# EAGLE design buttons_bevel (EAGLE 9.3.0)
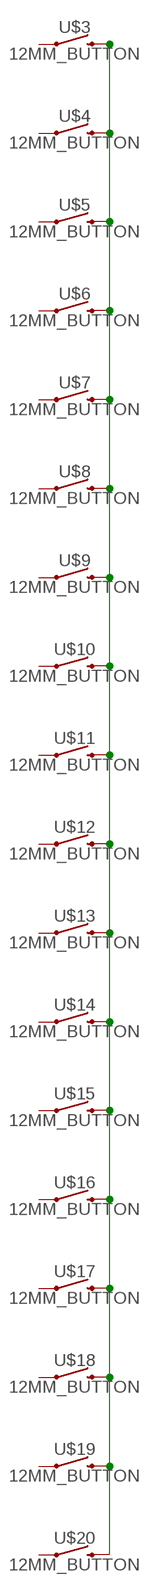
[diagram p0: schematic, sheet 1]

## Parts
U$3  12MM_BUTTON  [TACTILE_SWITCH_PTH_12MM]
U$4  12MM_BUTTON  [TACTILE_SWITCH_PTH_12MM]
U$5  12MM_BUTTON  [TACTILE_SWITCH_PTH_12MM]
U$6  12MM_BUTTON  [TACTILE_SWITCH_PTH_12MM]
U$7  12MM_BUTTON  [TACTILE_SWITCH_PTH_12MM]
U$8  12MM_BUTTON  [TACTILE_SWITCH_PTH_12MM]
U$9  12MM_BUTTON  [TACTILE_SWITCH_PTH_12MM]
U$10  12MM_BUTTON  [TACTILE_SWITCH_PTH_12MM]
U$11  12MM_BUTTON  [TACTILE_SWITCH_PTH_12MM]
U$12  12MM_BUTTON  [TACTILE_SWITCH_PTH_12MM]
U$13  12MM_BUTTON  [TACTILE_SWITCH_PTH_12MM]
U$14  12MM_BUTTON  [TACTILE_SWITCH_PTH_12MM]
U$15  12MM_BUTTON  [TACTILE_SWITCH_PTH_12MM]
U$16  12MM_BUTTON  [TACTILE_SWITCH_PTH_12MM]
U$17  12MM_BUTTON  [TACTILE_SWITCH_PTH_12MM]
U$18  12MM_BUTTON  [TACTILE_SWITCH_PTH_12MM]
U$19  12MM_BUTTON  [TACTILE_SWITCH_PTH_12MM]
U$20  12MM_BUTTON  [TACTILE_SWITCH_PTH_12MM]

## Nets
N$22: U$3.3 U$3.4 U$4.3 U$4.4 U$5.3 U$5.4 U$6.3 U$6.4 U$7.3 U$7.4 U$8.3 U$8.4 U$9.3 U$9.4 U$10.3 U$10.4 U$11.3 U$11.4 U$12.3 U$12.4 U$13.3 U$13.4 U$14.3 U$14.4 U$15.3 U$15.4 U$16.3 U$16.4 U$17.3 U$17.4 U$18.3 U$18.4 U$19.3 U$19.4 U$20.3 U$20.4
Unconnected: U$3.1 U$3.2 U$4.1 U$4.2 U$5.1 U$5.2 U$6.1 U$6.2 U$7.1 U$7.2 U$8.1 U$8.2 U$9.1 U$9.2 U$10.1 U$10.2 U$11.1 U$11.2 U$12.1 U$12.2 U$13.1 U$13.2 U$14.1 U$14.2 U$15.1 U$15.2 U$16.1 U$16.2 U$17.1 U$17.2 U$18.1 U$18.2 U$19.1 U$19.2 U$20.1 U$20.2

## Library data of the parts
U$3-U$20 = button:12MM_BUTTON

## Board
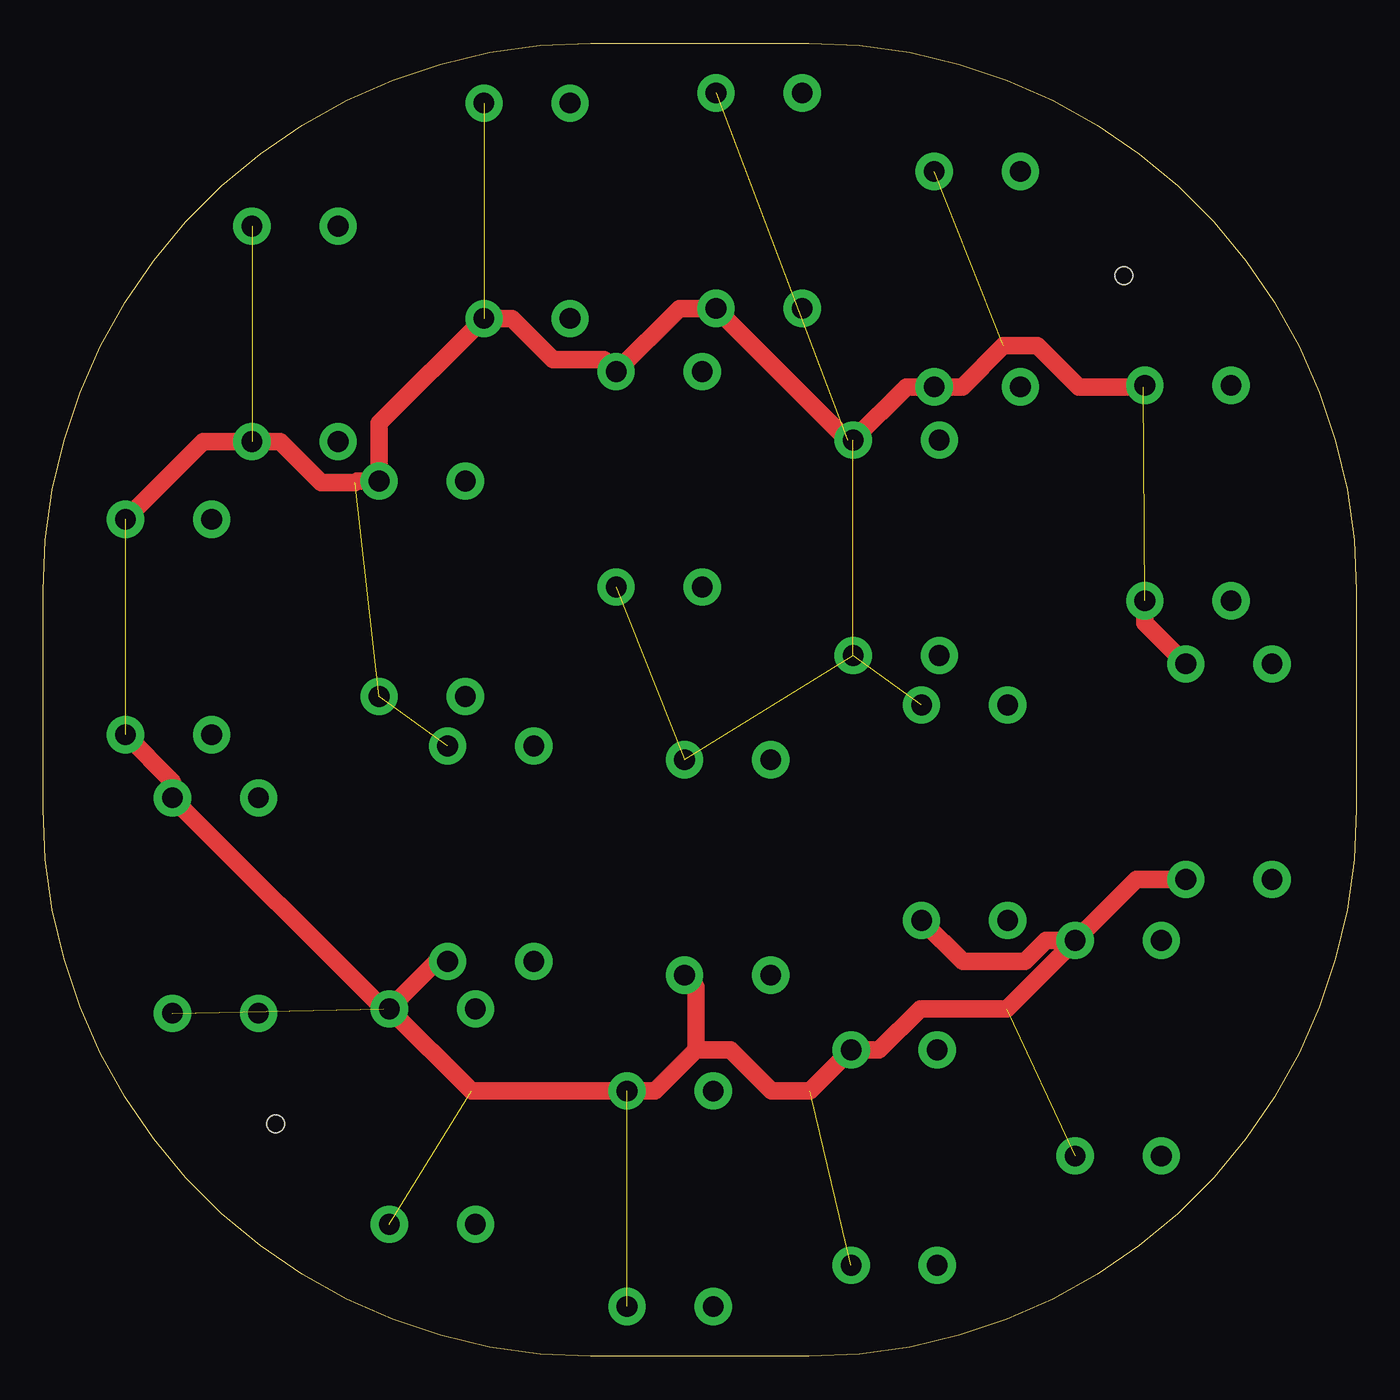
[diagram p1: board, top side]
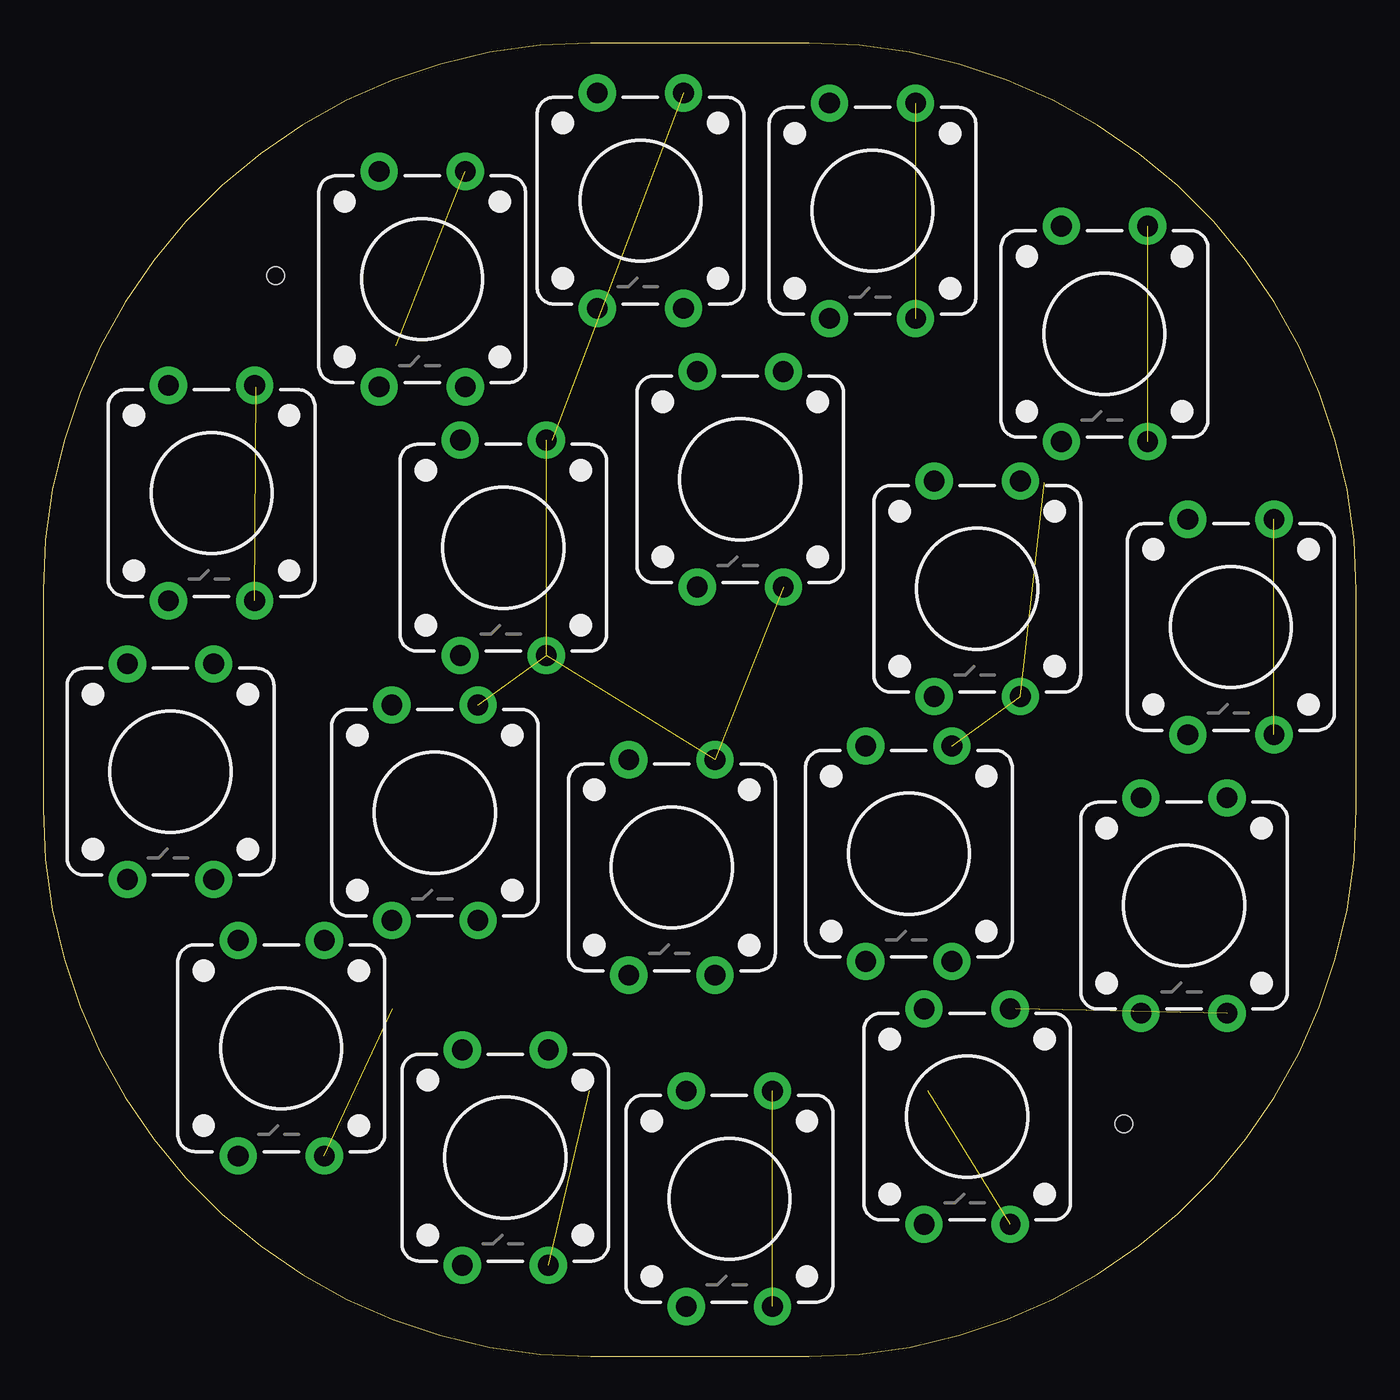
[diagram p2: board, bottom side, seen from below]

Size 76.2 x 76.2 mm. Coordinates in mm from the lower left corner, seen from the top.
Outline: 0,44.45 arc-90 31.75,76.2 44.45,76.2 arc-90 76.2,44.45 76.2,31.75 arc-90 44.45,0 31.75,0 arc-90 0,31.75 0,44.45
Copper layers (1*16): Top 0.035mm / dielectric 1.5mm / Bottom 0.035mm
Design rules "default": minimum track width 16mil, minimum drill 0.8mm, track to track 0.8mm, track to pad 0.8mm, pad to pad 0.8mm, via to via 0.8mm, smd to smd 0mil, copper to edge 1mil, drill to drill 1mil, minimum pad ring 10mil, minimum via ring 10mil, stop-mask expansion 1mil, vias tented up to drill 30mil, thermal gap 10mil
Holes 1 mm at 13.5,13.5 62.71,62.71

### Footprints (pad centres in the part's own frame; a part is rotated, then mirrored left to right if it is on the bottom)
TACTILE_SWITCH_PTH_12MM = drill 1.2 pad 2.159: 1 6.25,-2.5; 2 -6.25,-2.5; 3 6.25,2.5; 4 -6.25,2.5

### Placement (x,y rotation side)
U$3  7.28,42.33 270 bottom
U$4  62.38,17.88 270 bottom
U$5  66.42,50.1 270 bottom
U$6  10,26.16 270 bottom
U$7  54.21,62.5 270 bottom
U$8  22.59,13.91 270 bottom
U$9  68.81,33.93 270 bottom
U$10  14.62,59.33 270 bottom
U$11  28.08,66.47 270 bottom
U$12  22,44.54 270 bottom
U$13  35.75,50.89 270 bottom
U$14  41.54,67.06 270 bottom
U$15  49.5,46.92 270 bottom
U$16  49.38,11.53 270 bottom
U$17  25.97,29.17 270 bottom
U$18  39.72,28.37 270 bottom
U$19  53.47,31.55 270 bottom
U$20  36.38,9.15 270 bottom

### Tracks (layer width: path | path; a pad name or v marks a point on that pad's centre or on a via)
N$22  (17 unrouted)
  Top 1.016: U$3.3 7.5,33.36 U$6.4 19.75,20.16 U$8.4 | U$3.4 9.28,53.08 U$10.3 13.74,53.08 16.13,50.69 18.11,50.69 18.21,50.79 U$12.4 19.5,52.08 19.51,52.09 19.51,54.06 19.5,54.07 19.5,54.14 U$11.3 27.2,60.22 29.59,57.83 32.56,57.83 U$13.4 36.92,60.81 U$14.3 46.67,53.17 U$15.4 50.08,56.25 U$7.3 53.33,56.25 55.72,58.64 57.7,58.64 60.08,56.25 63.83,56.25 U$5.4 | U$5.3 63.92,42.56 U$9.4 | U$9.3 63.43,27.68 U$4.4 | U$4.4 55.92,20.17 50.89,20.17 48.51,17.78 U$16.4 44.5,15.4 42.26,15.4 39.87,17.79 37.89,17.79 | 37.89,17.79 35.51,15.4 U$20.4 24.85,15.4 U$8.4 | U$8.4 22.84,22.92 U$17.3 | 37.89,17.79 37.89,21.45 U$18.3 | U$4.4 58.18,24.13 56.96,22.91 53.36,22.91 U$19.3